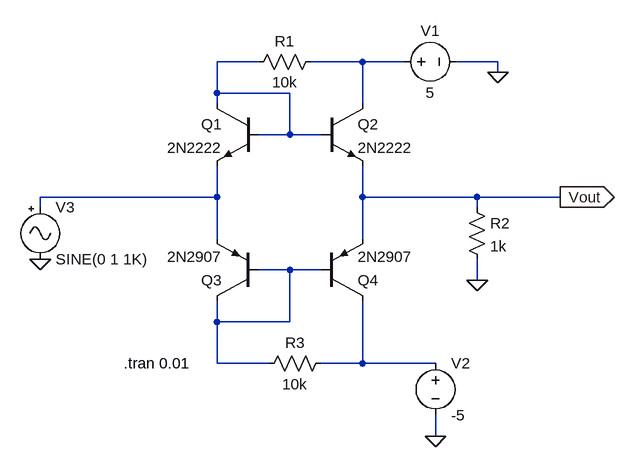
[diagram p0: schematic TEST7 - 15.asc]
TEST7 - 15.asc, the LTspice schematic file:
Version 4
SHEET 1 996 680
WIRE 432 80 368 80
WIRE 592 80 512 80
WIRE 656 80 592 80
WIRE 800 80 736 80
WIRE 800 96 800 80
WIRE 368 128 368 80
WIRE 480 128 368 128
WIRE 368 144 368 128
WIRE 592 144 592 80
WIRE 480 192 480 128
WIRE 480 192 432 192
WIRE 528 192 480 192
WIRE 368 288 368 240
WIRE 368 288 96 288
WIRE 592 288 592 240
WIRE 768 288 592 288
WIRE 896 288 768 288
WIRE 96 304 96 288
WIRE 768 304 768 288
WIRE 368 352 368 288
WIRE 592 352 592 288
WIRE 480 400 432 400
WIRE 528 400 480 400
WIRE 768 416 768 384
WIRE 368 480 368 448
WIRE 480 480 480 400
WIRE 480 480 368 480
WIRE 368 544 368 480
WIRE 448 544 368 544
WIRE 592 544 592 448
WIRE 592 544 528 544
WIRE 704 544 592 544
WIRE 704 656 704 624
FLAG 800 96 0
FLAG 768 416 0
FLAG 704 656 0
FLAG 96 384 0
FLAG 896 288 Vout
IOPIN 896 288 Out
SYMBOL voltage 640 80 R270
WINDOW 0 32 56 VTop 2
WINDOW 3 -32 56 VBottom 2
SYMATTR InstName V1
SYMATTR Value 5
SYMBOL npn 432 144 M0
SYMATTR InstName Q1
SYMATTR Value 2N2222
SYMBOL npn 528 144 R0
SYMATTR InstName Q2
SYMATTR Value 2N2222
SYMBOL pnp 432 448 R180
SYMATTR InstName Q3
SYMATTR Value 2N2907
SYMBOL pnp 528 448 M180
SYMATTR InstName Q4
SYMATTR Value 2N2907
SYMBOL res 528 64 R90
WINDOW 0 0 56 VBottom 2
WINDOW 3 32 56 VTop 2
SYMATTR InstName R1
SYMATTR Value 10k
SYMBOL res 752 288 R0
SYMATTR InstName R2
SYMATTR Value 1k
SYMBOL res 544 528 R90
WINDOW 0 0 56 VBottom 2
WINDOW 3 32 56 VTop 2
SYMATTR InstName R3
SYMATTR Value 10k
SYMBOL voltage 704 528 R0
SYMATTR InstName V2
SYMATTR Value -5
SYMBOL Misc/signal 96 288 R0
SYMATTR InstName V3
TEXT 224 544 Left 2 !.tran 0.01

The netlist it stands for:
* TEST7 - 15.asc
V1 N002 0 5
Q1 N001 N001 N003 0 2N2222
Q2 N002 N001 Vout 0 2N2222
Q3 N004 N004 N003 0 2N2907
Q4 N005 N004 Vout 0 2N2907
R1 N002 N001 10k
R2 Vout 0 1k
R3 N005 N004 10k
V2 N005 0 -5
V3 N003 0 SINE(0 1 1K)
.model NPN NPN
.model PNP PNP
.lib standard.bjt
.tran 0.01
.backanno
.end